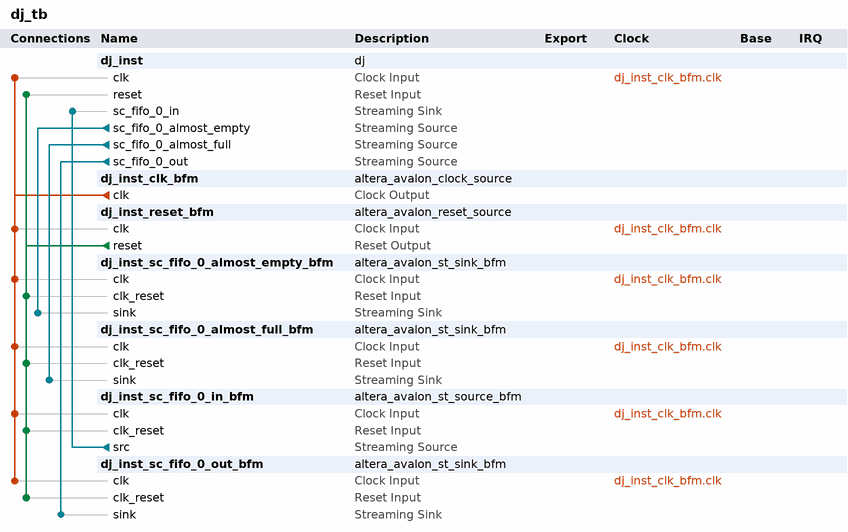
[diagram p0: system contents]
# Platform Designer (Qsys) system dj_tb, Cyclone V 5CEBA2F17A7
# Parameters at their usual value, and those the tool derives, are not listed.
package require -exact qsys 23.1
create_system dj_tb
set_project_property DEVICE_FAMILY {Cyclone V}
set_project_property DEVICE 5CEBA2F17A7

add_instance dj_inst dj 1.0

add_instance dj_inst_clk_bfm altera_avalon_clock_source 23.1

add_instance dj_inst_reset_bfm altera_avalon_reset_source 23.1
set_instance_parameter_value dj_inst_reset_bfm ASSERT_HIGH_RESET 0
set_instance_parameter_value dj_inst_reset_bfm INITIAL_RESET_CYCLES 50

add_instance dj_inst_sc_fifo_0_almost_empty_bfm altera_avalon_st_sink_bfm 23.1
set_instance_parameter_value dj_inst_sc_fifo_0_almost_empty_bfm ST_CHANNEL_W 1
set_instance_parameter_value dj_inst_sc_fifo_0_almost_empty_bfm ST_ERROR_W 1
set_instance_parameter_value dj_inst_sc_fifo_0_almost_empty_bfm ST_MAX_CHANNELS 0
set_instance_parameter_value dj_inst_sc_fifo_0_almost_empty_bfm ST_NUMSYMBOLS 1
set_instance_parameter_value dj_inst_sc_fifo_0_almost_empty_bfm ST_READY_LATENCY 0
set_instance_parameter_value dj_inst_sc_fifo_0_almost_empty_bfm ST_SYMBOL_W 1
set_instance_parameter_value dj_inst_sc_fifo_0_almost_empty_bfm USE_CHANNEL 0
set_instance_parameter_value dj_inst_sc_fifo_0_almost_empty_bfm USE_EMPTY 0
set_instance_parameter_value dj_inst_sc_fifo_0_almost_empty_bfm USE_ERROR 0
set_instance_parameter_value dj_inst_sc_fifo_0_almost_empty_bfm USE_PACKET 0
set_instance_parameter_value dj_inst_sc_fifo_0_almost_empty_bfm USE_READY 0
set_instance_parameter_value dj_inst_sc_fifo_0_almost_empty_bfm USE_VALID 0
set_instance_parameter_value dj_inst_sc_fifo_0_almost_empty_bfm VHDL_ID 0

add_instance dj_inst_sc_fifo_0_almost_full_bfm altera_avalon_st_sink_bfm 23.1
set_instance_parameter_value dj_inst_sc_fifo_0_almost_full_bfm ST_CHANNEL_W 1
set_instance_parameter_value dj_inst_sc_fifo_0_almost_full_bfm ST_ERROR_W 1
set_instance_parameter_value dj_inst_sc_fifo_0_almost_full_bfm ST_MAX_CHANNELS 0
set_instance_parameter_value dj_inst_sc_fifo_0_almost_full_bfm ST_NUMSYMBOLS 1
set_instance_parameter_value dj_inst_sc_fifo_0_almost_full_bfm ST_READY_LATENCY 0
set_instance_parameter_value dj_inst_sc_fifo_0_almost_full_bfm ST_SYMBOL_W 1
set_instance_parameter_value dj_inst_sc_fifo_0_almost_full_bfm USE_CHANNEL 0
set_instance_parameter_value dj_inst_sc_fifo_0_almost_full_bfm USE_EMPTY 0
set_instance_parameter_value dj_inst_sc_fifo_0_almost_full_bfm USE_ERROR 0
set_instance_parameter_value dj_inst_sc_fifo_0_almost_full_bfm USE_PACKET 0
set_instance_parameter_value dj_inst_sc_fifo_0_almost_full_bfm USE_READY 0
set_instance_parameter_value dj_inst_sc_fifo_0_almost_full_bfm USE_VALID 0
set_instance_parameter_value dj_inst_sc_fifo_0_almost_full_bfm VHDL_ID 1

add_instance dj_inst_sc_fifo_0_in_bfm altera_avalon_st_source_bfm 23.1
set_instance_parameter_value dj_inst_sc_fifo_0_in_bfm ST_CHANNEL_W 1
set_instance_parameter_value dj_inst_sc_fifo_0_in_bfm ST_ERROR_W 1
set_instance_parameter_value dj_inst_sc_fifo_0_in_bfm ST_MAX_CHANNELS 0
set_instance_parameter_value dj_inst_sc_fifo_0_in_bfm ST_NUMSYMBOLS 2
set_instance_parameter_value dj_inst_sc_fifo_0_in_bfm ST_SYMBOL_W 8
set_instance_parameter_value dj_inst_sc_fifo_0_in_bfm USE_CHANNEL 0
set_instance_parameter_value dj_inst_sc_fifo_0_in_bfm USE_EMPTY 0
set_instance_parameter_value dj_inst_sc_fifo_0_in_bfm USE_ERROR 0
set_instance_parameter_value dj_inst_sc_fifo_0_in_bfm USE_PACKET 0
set_instance_parameter_value dj_inst_sc_fifo_0_in_bfm USE_READY 1
set_instance_parameter_value dj_inst_sc_fifo_0_in_bfm USE_VALID 1

add_instance dj_inst_sc_fifo_0_out_bfm altera_avalon_st_sink_bfm 23.1
set_instance_parameter_value dj_inst_sc_fifo_0_out_bfm ST_CHANNEL_W 1
set_instance_parameter_value dj_inst_sc_fifo_0_out_bfm ST_ERROR_W 1
set_instance_parameter_value dj_inst_sc_fifo_0_out_bfm ST_MAX_CHANNELS 0
set_instance_parameter_value dj_inst_sc_fifo_0_out_bfm ST_NUMSYMBOLS 2
set_instance_parameter_value dj_inst_sc_fifo_0_out_bfm ST_READY_LATENCY 0
set_instance_parameter_value dj_inst_sc_fifo_0_out_bfm ST_SYMBOL_W 8
set_instance_parameter_value dj_inst_sc_fifo_0_out_bfm USE_CHANNEL 0
set_instance_parameter_value dj_inst_sc_fifo_0_out_bfm USE_EMPTY 0
set_instance_parameter_value dj_inst_sc_fifo_0_out_bfm USE_ERROR 0
set_instance_parameter_value dj_inst_sc_fifo_0_out_bfm USE_PACKET 0
set_instance_parameter_value dj_inst_sc_fifo_0_out_bfm USE_READY 1
set_instance_parameter_value dj_inst_sc_fifo_0_out_bfm USE_VALID 1
set_instance_parameter_value dj_inst_sc_fifo_0_out_bfm VHDL_ID 2

# connections
add_connection dj_inst_clk_bfm.clk dj_inst.clk clock
add_connection dj_inst_clk_bfm.clk dj_inst_reset_bfm.clk clock
add_connection dj_inst_clk_bfm.clk dj_inst_sc_fifo_0_almost_empty_bfm.clk clock
add_connection dj_inst_clk_bfm.clk dj_inst_sc_fifo_0_almost_full_bfm.clk clock
add_connection dj_inst_clk_bfm.clk dj_inst_sc_fifo_0_in_bfm.clk clock
add_connection dj_inst_clk_bfm.clk dj_inst_sc_fifo_0_out_bfm.clk clock
add_connection dj_inst_reset_bfm.reset dj_inst.reset reset
add_connection dj_inst_reset_bfm.reset dj_inst_sc_fifo_0_almost_empty_bfm.clk_reset reset
add_connection dj_inst_reset_bfm.reset dj_inst_sc_fifo_0_almost_full_bfm.clk_reset reset
add_connection dj_inst_reset_bfm.reset dj_inst_sc_fifo_0_in_bfm.clk_reset reset
add_connection dj_inst_reset_bfm.reset dj_inst_sc_fifo_0_out_bfm.clk_reset reset
add_connection dj_inst.sc_fifo_0_almost_empty dj_inst_sc_fifo_0_almost_empty_bfm.sink avalon_streaming
add_connection dj_inst.sc_fifo_0_almost_full dj_inst_sc_fifo_0_almost_full_bfm.sink avalon_streaming
add_connection dj_inst.sc_fifo_0_out dj_inst_sc_fifo_0_out_bfm.sink avalon_streaming
add_connection dj_inst_sc_fifo_0_in_bfm.src dj_inst.sc_fifo_0_in avalon_streaming

set_interconnect_requirement {$system} qsys_mm.clockCrossingAdapter HANDSHAKE
set_interconnect_requirement {$system} qsys_mm.enableEccProtection FALSE
set_interconnect_requirement {$system} qsys_mm.insertDefaultSlave FALSE
set_interconnect_requirement {$system} qsys_mm.maxAdditionalLatency 1

save_system dj_tb.qsys
